# EasyEDA Pro project ProPrj_wildCat_2025-03-28.epro

# Schematic Schematic3_1
Board Name: 4ldouble; Create Date: 2025-03-23; Page Name: P1; Project Name: wildCat; Schematic Name: Schematic3_1; Update Date: 2025-03-23; Company: 嘉立创EDA; Page Size: A4; Version: V1.0
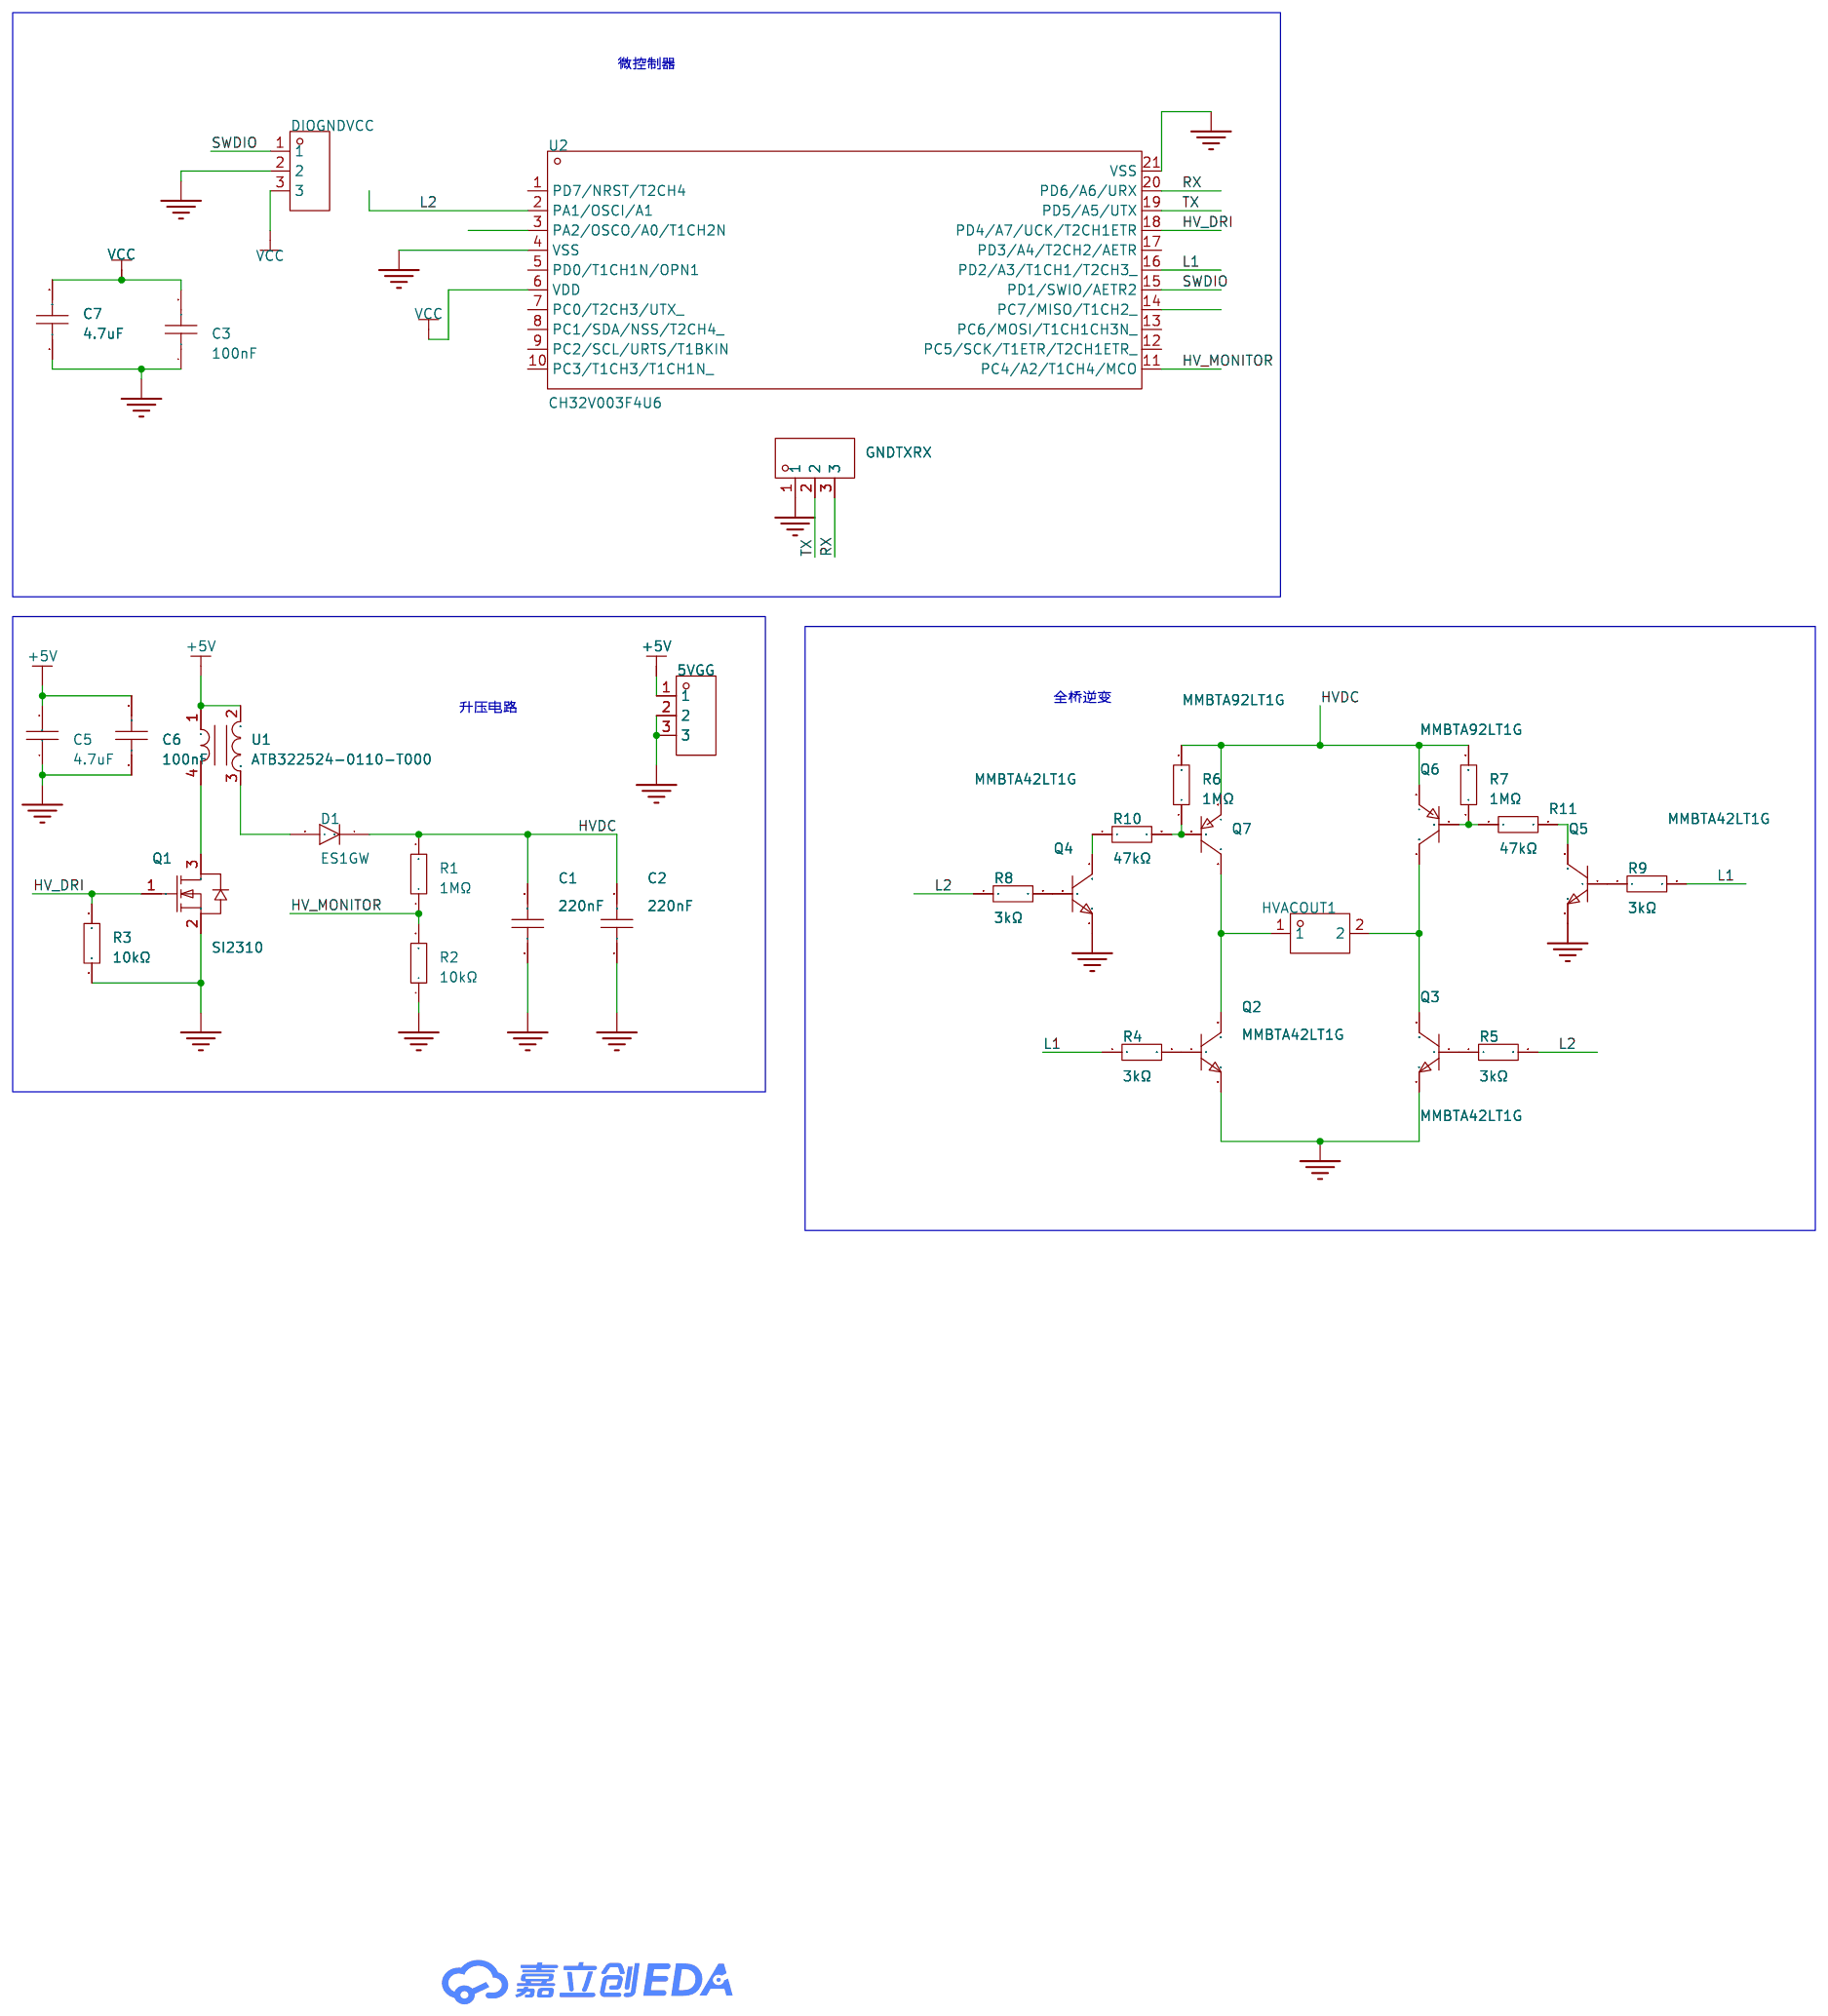
[diagram p0: schematic sheet]

## Parts
5VGG  -  [HDR-TH_3P-P2.54-V-F]
C1  220nF  [C1210]
C2  220nF  [C1210]
C3  100nF  [C0603]
C5  4.7uF  [C0805]
C6  100nF  [C0603]
C7  4.7uF  [C0603]
D1  ES1GW  [SOD-123FL_L2.7-W1.8-LS3.8-RD]
DIOGNDVCC  -  [HDR-TH_3P-P2.54-V-F]
GNDTXRX  -  [HDR-TH_3P-P2.54-V-F]
HVACOUT1  -  [HDR-TH_2P-P2.54-V-M-2]
Q1  SI2310  [SOT-23_L2.9-W1.3-P1.90-LS2.4-BR]
Q2  MMBTA42LT1G  [SOT-23-3_L2.9-W1.6-P1.90-LS2.8-BR]
Q3  MMBTA42LT1G  [SOT-23-3_L2.9-W1.6-P1.90-LS2.8-BR]
Q4  MMBTA42LT1G  [SOT-23-3_L2.9-W1.6-P1.90-LS2.8-BR]
Q5  MMBTA42LT1G  [SOT-23-3_L2.9-W1.6-P1.90-LS2.8-BR]
Q6  MMBTA92LT1G  [SOT-23-3_L2.9-W1.6-P1.90-LS2.8-BR]
Q7  MMBTA92LT1G  [SOT-23-3_L2.9-W1.6-P1.90-LS2.8-BR]
R1  1MΩ  [R1206]
R2  10kΩ  [R0402]
R3  10kΩ  [R0402]
R4  3kΩ  [R0402]
R5  3kΩ  [R0402]
R6  1MΩ  [R0402]
R7  1MΩ  [R0402]
R8  3kΩ  [R0402]
R9  3kΩ  [R0402]
R10  47kΩ  [R1206]
R11  47kΩ  [R1206]
U1  ATB322524-0110-T000  [XFMR-SMD_ATB322515-0110-T000]
U2  CH32V003F4U6  [QFN-20_L3.0-W3.0-P0.40-TL-EP1.7]

## Library data of the parts
5VGG DIOGNDVCC GNDTXRX = HDR-F_2.54_1x3P: Supplier Part: C541850; Supplier Footprint: 插件; Check: false
C1 C2 = CC1210KKX7RYBB224: 容值:220nF;精度:±10%;额定电压:250V;材质(温度系数):X7R;; LCSC Part Name: 220nF ±10% 250V; Supplier Part: C326671; Manufacturer: YAGEO(国巨); Supplier Footprint: 1210; JLCPCB Part Class: 扩展库; Datasheet: https://atta.szlcsc.com/upload/public/pdf/source/20181031/C326671_E05A76D6DA213ECA4F67921FD917BD9F.pdf; Supplier: LCSC; Tolerance: ±10%; Voltage Rated: 250V; Temperature Coefficient: X7R
C3 C6 = CGA0603X7R104K500JT: 容值:100nF;精度:±10%;额定电压:50V;温度系数:X7R;; LCSC Part Name: 100nF ±10% 50V; Supplier Part: C6119867; Manufacturer: HRE(芯声); Supplier Footprint: 0603; JLCPCB Part Class: 扩展库; Datasheet: https://atta.szlcsc.com/upload/public/pdf/source/20250103/C44077DA9E7B3EFAE02F22B6D3D1CBC9.pdf; Supplier: LCSC; Tolerance: ±10%; Voltage Rating: 50V; Temperature Coefficient: X7R
C5 = CL21A475KBQNNNE: 容值:4.7uF;精度:±10%;额定电压:50V;材质(温度系数):X5R;; LCSC Part Name: 4.7uF ±10% 50V; Supplier Part: C98192; Manufacturer: SAMSUNG(三星); Supplier Footprint: 0805; JLCPCB Part Class: 扩展库; Datasheet: https://atta.szlcsc.com/upload/public/pdf/source/20160218/1457707763339.pdf; Supplier: LCSC; Tolerance: ±10%; Voltage Rated: 50V; Temperature Coefficient: X5R
C7 = CL10A475KO8NNNC: 容值:4.7uF;精度:±10%;额定电压:16V;材质(温度系数):X5R;; LCSC Part Name: 4.7uF ±10% 16V; Supplier Part: C19666; Manufacturer: SAMSUNG(三星); Supplier Footprint: 0603; JLCPCB Part Class: Basic Part; Datasheet: https://atta.szlcsc.com/upload/public/pdf/source/20160218/1457707763339.pdf; Supplier: LCSC; Tolerance: ±10%; Voltage Rated: 16V; Temperature Coefficient: X5R
D1 = ES1GW_C128697: 二极管配置:独立式;正向压降(Vf):1.25V@1A;直流反向耐压(Vr):400V;整流电流:1A;反向恢复时间(trr):35ns;; Supplier Part: C128697; Manufacturer: 晶导微电子; Supplier Footprint: SOD-123F; JLCPCB Part Class: 扩展库; Datasheet: https://atta.szlcsc.com/upload/public/pdf/source/20170918/C128697_1505700123436974922.pdf; Supplier: LCSC; Diode Configuration: 独立式; Forward Voltage (Vf@If): 1.25V@1A; Reverse Voltage (Vr): 400V; Rectified Current: 1A; Reverse Leakage Current (Ir): 5uA@400V; Reverse Recovery Time (trr): 35ns; Operating Temperature: -55℃~+150℃@(Tj)
HVACOUT1 = HDR-M_2.54_2x1: Supplier Part: C2883961; Supplier Footprint: 插件,P=2.54mm; Check: false
Q1 = SI2310_C2938374: 类型:-;漏源电压(Vdss):60V;连续漏极电流(Id):3A;导通电阻(RDS(on)):125mΩ@4.5V,3A;耗散功率(Pd):1.5W;阈值电压(Vgs(th)):500mV;; LCSC Part Name: N沟道,电流:3A,耐压:60V; Supplier Part: C2938374; Manufacturer: GOODWORK(固得沃克); Supplier Footprint: SOT-23; JLCPCB Part Class: 扩展库; Datasheet: https://atta.szlcsc.com/upload/public/pdf/source/20240805/D069A40A104CC19EC37E6FD1F86C8B27.pdf; Supplier: LCSC; Drain to Source Voltage: 60V; Current - Continuous Drain(Id): 3A; RDS(on): 125mΩ@4.5V,3A; Pd - Power Dissipation: 1.5W; Gate Threshold Voltage (Vgs(th)@Id): 500mV; Gate Charge(Qg): 6nC@10V; Input Capacitance(Ciss@Vds): 247pF; Reverse Transfer Capacitance (Crss@Vds): 19.5pF; Operating Temperature: -55℃~+150℃
Q2-Q5 = MMBTA42LT1G: 晶体管类型:NPN;集电极电流(Ic):500mA;集射极击穿电压(Vceo):300V;功率(Pd):225mW;直流电流增益(hFE@Ic,Vce):25@10mA,10V;; LCSC Part Name: NPN 电流:500mA 耐压:300V; Supplier Part: C94389; Manufacturer: onsemi(安森美); Supplier Footprint: SOT-23; JLCPCB Part Class: Extended Part; Datasheet: https://atta.szlcsc.com/upload/public/pdf/source/20191223/C462960_9D0C1868A1806633932A5B836B4BA46D.pdf; Supplier: LCSC; Transistor Type: NPN; Collector Current (Ic): 500mA; Collector-Emitter Breakdown Voltage (Vceo): 300V; Power Dissipation (Pd): 225mW; DC Current Gain (hFE@Ic,Vce): 25@10mA,10V; Transition Frequency (fT): 50MHz; Collector Cut-Off Current (Icbo): 100nA; Collector-Emitter Saturation Voltage (VCE(sat)@Ic,Ib): 500mV@20mA,2.0mA; Operating Temperature: -55℃~+150℃
Q6 Q7 = MMBTA92LT1G: 晶体管类型:PNP;集电极电流(Ic):500mA;集射极击穿电压(Vceo):300V;功率(Pd):225mW;直流电流增益(hFE@Ic,Vce):25@1.0mA,10V;; LCSC Part Name: PNP 电流:500mA 耐压:300V; Supplier Part: C82049; Manufacturer: onsemi(安森美); Supplier Footprint: SOT-23; JLCPCB Part Class: Extended Part; Datasheet: https://atta.szlcsc.com/upload/public/pdf/source/20160910/1473490306913.PDF; Supplier: LCSC; Transistor Type: PNP; Collector Current (Ic): 500mA; Collector-Emitter Breakdown Voltage (Vceo): 300V; Power Dissipation (Pd): 225mW; DC Current Gain (hFE@Ic,Vce): 25@1.0mA,10V; Transition Frequency (fT): 50MHz; Collector Cut-Off Current (Icbo): 250nA; Collector-Emitter Saturation Voltage (VCE(sat)@Ic,Ib): 500mV@20mA,2.0mA; Operating Temperature: -55℃~+150℃
R1 R6 R7 = 0402WGF1004TCE: 电阻类型:厚膜电阻;阻值:1MΩ;精度:±1%;功率:62.5mW;最大工作电压:50V;温度系数:±100ppm/℃;; LCSC Part Name: 1MΩ ±1% 62.5mW 厚膜电阻; Supplier Part: C26083; Manufacturer: UNI-ROYAL(厚声); Supplier Footprint: 0402; JLCPCB Part Class: Basic Part; Datasheet: https://atta.szlcsc.com/upload/public/pdf/source/20200306/C422600_1E6D84923E4A46A82E41ADD87F860B5C.pdf; Supplier: LCSC; Type: 厚膜电阻; Tolerance: ±1%; Power(Watts): 62.5mW; Overload Voltage (Max): 50V; Temperature Coefficient: ±100ppm/℃; Operating Temperature Range: -55℃~+155℃
R2 R3 = 0402WGF1002TCE: 电阻类型:厚膜电阻;阻值:10kΩ;精度:±1%;功率:62.5mW;最大工作电压:50V;温度系数:±100ppm/℃;; LCSC Part Name: 10kΩ ±1% 62.5mW 厚膜电阻; Supplier Part: C25744; Manufacturer: UNI-ROYAL(厚声); Supplier Footprint: 0402; JLCPCB Part Class: Basic Part; Datasheet: https://atta.szlcsc.com/upload/public/pdf/source/20200306/C422600_1E6D84923E4A46A82E41ADD87F860B5C.pdf; Supplier: LCSC; Type: 厚膜电阻; Tolerance: ±1%; Power(Watts): 62.5mW; Overload Voltage (Max): 50V; Temperature Coefficient: ±100ppm/℃; Operating Temperature Range: -55℃~+155℃
R4 R5 R8 R9 = FRC0402F3001TS: 电阻类型:厚膜电阻;阻值:3kΩ;精度:±1%;功率:62.5mW;最大工作电压:50V;温度系数:±100ppm/℃;; LCSC Part Name: 3kΩ ±1% 62.5mW 厚膜电阻; Supplier Part: C2909355; Manufacturer: FOJAN(富捷); Supplier Footprint: 0402; JLCPCB Part Class: Extended Part; Datasheet: https://atta.szlcsc.com/upload/public/pdf/source/20211221/925EC7D7225764EE0046F22065062C87.pdf; Supplier: LCSC; Type: 厚膜电阻; Tolerance: ±1%; Power(Watts): 62.5mW; Overload Voltage (Max): 50V; Temperature Coefficient: ±100ppm/℃; Operating Temperature Range: -55℃~+155℃
R10 R11 = 0402WGF4702TCE: 电阻类型:厚膜电阻;阻值:47kΩ;精度:±1%;功率:62.5mW;最大工作电压:50V;温度系数:±100ppm/℃;; LCSC Part Name: 47kΩ ±1% 62.5mW 厚膜电阻; Supplier Part: C25792; Manufacturer: UNI-ROYAL(厚声); Supplier Footprint: 0402; JLCPCB Part Class: Basic Part; Datasheet: https://atta.szlcsc.com/upload/public/pdf/source/20200306/C422600_1E6D84923E4A46A82E41ADD87F860B5C.pdf; Supplier: LCSC; Type: 厚膜电阻; Tolerance: ±1%; Power(Watts): 62.5mW; Overload Voltage (Max): 50V; Temperature Coefficient: ±100ppm/℃; Operating Temperature Range: -55℃~+155℃
U1 = ATB322524-0110-T000: 初级电压:-;次级电压:-;输出电流:-;功率:-;; LCSC Part Name: 升压变压器; Supplier Part: C249001; Manufacturer: TDK; Supplier Footprint: SMD; JLCPCB Part Class: 扩展库; Datasheet: https://atta.szlcsc.com/upload/public/pdf/source/20180719/C249001_45035A300399F2A41F111958812A8988.pdf; Supplier: LCSC
U2 = CH32V003F4U6: CPU内核:RISC-V;程序存储容量:16KB;RAM总容量:2KB;GPIO端口数量:18;工作电压范围:-;CPU最大主频:48MHz;程序存储器类型:-;应用领域:-;; Supplier Part: C5299908; Manufacturer: WCH(南京沁恒); Supplier Footprint: QFN-20(3X3); JLCPCB Part Class: 扩展库; Datasheet: https://atta.szlcsc.com/upload/public/pdf/source/20240313/77CE2EF5E2A3AF5A92256F1D84EF4244.pdf; Supplier: LCSC; CPU Core: RISC-V; Program Storage Size: 16KB; RAM Size: 2KB; GPIO Ports Number: 18; CPU Maximum Speed: 48MHz; UART/USART: 1; I2C: 1; SPI: 1; Watchdog: 有; Real-Time Clock: 有

## Nets
+5V: 5VGG.1 C5.2 C6.2 U1.1 U1.2
GND: 5VGG.2 5VGG.3 C1.1 C2.1 C3.1 C5.1 C6.1 C7.1 DIOGNDVCC.2 GNDTXRX.1 Q1.2(S) Q2.2 Q3.2 Q4.2 Q5.2 R2.1 R3.1 U2.4(VSS) U2.21(VSS)
VCC: C3.2 C7.2 DIOGNDVCC.3 U2.6(VDD)
HV_DRI: Q1.1(G) R3.2 U2.18(PD4/A7/UCK/T2CH1ETR)
HV_MONITOR: R1.1 R2.2 U2.11(PC4/A2/T1CH4/MCO)
HVDC: C1.2 C2.2 D1.1(C) Q6.2(E) Q7.2(E) R1.2 R6.2 R7.2
L1: R4.1 R9.2 U2.16(PD2/A3/T1CH1/T2CH3_)
L2: R5.2 R8.1 U2.2(PA1/OSCI/A1)
RX: GNDTXRX.3 U2.20(PD6/A6/URX)
SWDIO: DIOGNDVCC.1 U2.15(PD1/SWIO/AETR2)
TX: GNDTXRX.2 U2.19(PD5/A5/UTX)
$1N1488: Q5.3 R11.2
$1N1491: Q5.1 R9.1
$1N1498: Q3.1 R5.1
$1N1505: Q6.1(B) R7.1 R11.1
$1N1517: HVACOUT1.2 Q3.3 Q6.3(C)
$1N1527: D1.2(A) U1.3
$1N1533: Q4.1 R8.2
$1N1535: Q4.3 R10.1
$1N1547: Q1.3(D) U1.4
$1N1565: HVACOUT1.1 Q2.3 Q7.3(C)
$1N1566: Q2.1 R4.2
$1N1568: Q7.1(B) R6.1 R10.2

Not connected (* = marked no-connect by the designer): U2 1(PD7/NRST/T2CH4) 3(PA2/OSCO/A0/T1CH2N) 5(PD0/T1CH1N/OPN1) 7(PC0/T2CH3/UTX_) 8(PC1/SDA/NSS/T2CH4_) 9(PC2/SCL/URTS/T1BKIN) 10(PC3/T1CH3/T1CH1N_) 12(PC5/SCK/T1ETR/T2CH1ETR_) 13(PC6/MOSI/T1CH1CH3N_) 14(PC7/MISO/T1CH2_) 17(PD3/A4/T2CH2/AETR)

## Notes on the sheet
- 微控制器
- 升压电路
- 全桥逆变

# Board PCB2_1
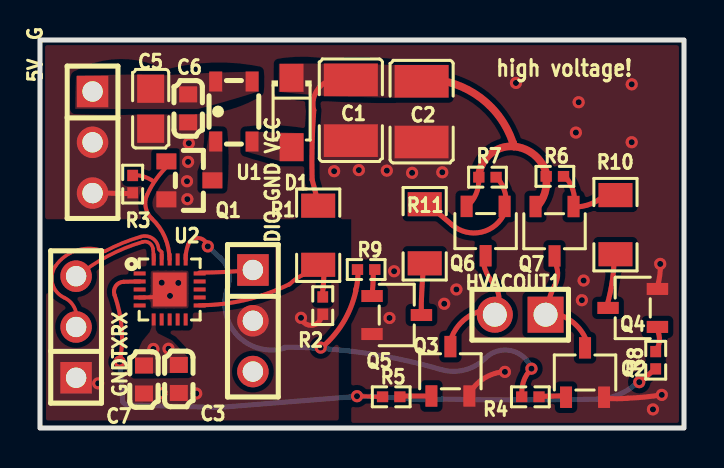
[diagram p1: board, top side]
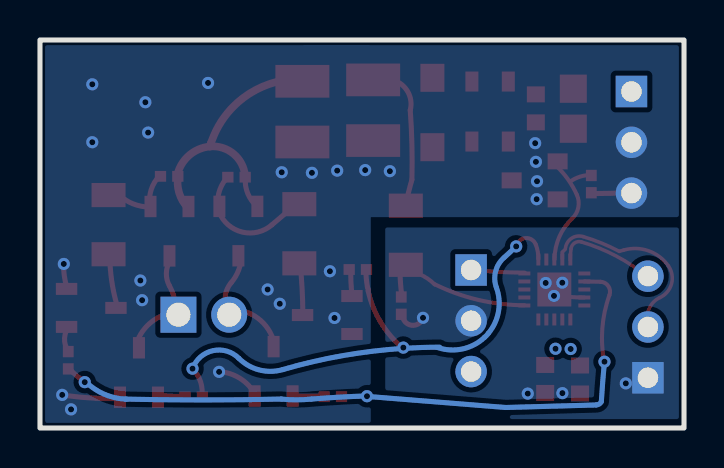
[diagram p2: board, bottom side, seen from below]

Outline 32.21 x 19.4 mm; copper layers: Top Layer, Inner1, Inner2, Bottom Layer. Coordinates in mm from the lower left corner of the outline.
Outline path: rectangle 0,19.4 32.21,0
Stack: Top Layer 0.035mm 外层铜厚1oz / Dielectric1 0.2104mm 7628 RC49% 8.6mil / Inner1 0.0152mm 内层铜厚 / Dielectric2 1.065mm 1.1mm H/HOZ Copper / Inner2 0.0152mm 内层铜厚 / Dielectric3 0.2104mm 7628 RC49% 8.6mil / Bottom Layer 0.035mm 外层铜厚1oz

## Design rules (mm)
net GND: LV
net +5V: LV
net HVDC: HV
net VCC: LV
net $1N1527: LV
net SWDIO: LV
net RX: LV
net TX: LV
net $1N1517: HV
net $1N1565: HV
net $1N1547: LV
net HV_DRI: LV
net $1N1566: LV
net $1N1498: LV
net $1N1533: LV
net $1N1535: HV
net $1N1491: LV
net $1N1488: HV
net $1N1505: HV
net $1N1568: HV
net HV_MONITOR: LV
net L1: LV
net L2: LV
template: 自定义配置
spacing copperThickness1oz (default): track to track 0.102, other pairs 0.152 to 0.3
spacing copperThickness2oz: track to track 0.203, other pairs 0.152 to 0.3
spacing HVClearance: track to track 0.254, other pairs 0.152 to 0.305
track width copperThickness1oz (default): min 0.127, default 0.254, max 2.54
track width copperThickness2oz: min 0.203, default 0.254, max 2.54
differential pair differentialPair (default): width min 0.127, default 0.254, max 2.54; gap min 0.152, default 0.152
via viaSize (default): diameter min 0.5, default 0.61, max 10; hole min 0.3, default 0.305, max 6.299
['net class', 'hv'] ['NET_CLASS', 'LV'] uses HVClearance

## Placement (name value [footprint] x y rotation side)
5V  G   G  -  [HDR-TH_3P-P2.54-V-F]  2.63 14.29 270 top
C1  220nF  [C1210]  15.55 15.89 90 top
C2  220nF  [C1210]  19.09 15.82 90 top
C3  100nF  [C0603]  6.94 2.45 90 top
C5  4.7uF  [C0805]  5.54 15.97 90 top
C6  100nF  [C0603]  7.41 15.98 90 top
C7  4.7uF  [C0603]  5.2 2.43 90 top
D1  ES1GW  [SOD-123FL_L2.7-W1.8-LS3.8-RD]  12.59 15.78 270 top
DIO GND VCC  -  [HDR-TH_3P-P2.54-V-F]  10.65 5.36 270 top
GNDTXRX  -  [HDR-TH_3P-P2.54-V-F]  1.81 5.05 90 top
HVACOUT1  -  [HDR-TH_2P-P2.54-V-M-2]  24.02 5.67 90 top
Q1  SI2310  [SOT-23_L2.9-W1.3-P1.90-LS2.4-BR]  7.47 12.38 180 top
Q2  MMBTA42LT1G  [SOT-23-3_L2.9-W1.6-P1.90-LS2.8-BR]  27.26 2.77 270 top
Q3  MMBTA42LT1G  [SOT-23-3_L2.9-W1.6-P1.90-LS2.8-BR]  20.53 2.84 270 top
Q4  MMBTA42LT1G  [SOT-23-3_L2.9-W1.6-P1.90-LS2.8-BR]  29.65 6.01 0 top
Q5  MMBTA42LT1G  [SOT-23-3_L2.9-W1.6-P1.90-LS2.8-BR]  17.84 5.65 180 top
Q6  MMBTA92LT1G  [SOT-23-3_L2.9-W1.6-P1.90-LS2.8-BR]  22.29 9.85 90 top
Q7  MMBTA92LT1G  [SOT-23-3_L2.9-W1.6-P1.90-LS2.8-BR]  25.74 9.84 90 top
R1  1MΩ  [R1206]  13.92 9.64 90 top
R2  10kΩ  [R0402]  14.14 6.12 90 top
R3  10kΩ  [R0402]  4.64 12.2 90 top
R4  3kΩ  [R0402]  24.53 1.56 0 top
R5  3kΩ  [R0402]  17.57 1.56 180 top
R6  1MΩ  [R0402]  25.75 12.58 180 top
R7  1MΩ  [R0402]  22.38 12.54 180 top
R8  3kΩ  [R0402]  30.8 3.39 90 top
R9  3kΩ  [R0402]  16.31 7.92 180 top
R10  47kΩ  [R1206]  28.78 10.17 90 top
R11  47kΩ  [R1206]  19.24 9.71 270 top
U1  ATB322524-0110-T000  [XFMR-SMD_ATB322515-0110-T000]  9.7 15.83 270 top
U2  CH32V003F4U6  [QFN-20_L3.0-W3.0-P0.40-TL-EP1.7]  6.49 6.93 0 top

## Footprints (pads in the part's own frame, mm; a bottom-side part is the same pattern mirrored in y, then rotated)
C0603
  rect 0.8x0.9 smd: 1(-0.7,0) 2(0.7,0)
C0805
  rect 1.41x1.35 smd: 1(-1,0) 2(1,0)
C1210
  rect 1.635x2.7 smd: 1(-1.518,0) 2(1.518,0)
HDR-TH_2P-P2.54-V-M-2
  rect 1.8x1.8 hole 1.2: 1(0,-1.27)
  round 1.8 hole 1.2: 2(0,1.27)
HDR-TH_3P-P2.54-V-F
  rect 1.575x1.575 hole 1.02: 1(-2.54,0)
  round 1.575 hole 1.02: 2(0,0) 3(2.54,0)
QFN-20_L3.0-W3.0-P0.40-TL-EP1.7
  rect 0.6x0.2 smd: 1(-1.5,0.8) 2(-1.5,0.401) 3(-1.5,0) 4(-1.5,-0.4) 5(-1.5,-0.8) 11(1.5,-0.8) 12(1.5,-0.4) 13(1.5,0) 14(1.5,0.401) 15(1.5,0.8)
  rect 0.2x0.6 smd: 6(-0.8,-1.5) 7(-0.4,-1.5) 8(0,-1.5) 9(0.4,-1.5) 10(0.799,-1.5) 16(0.8,1.5) 17(0.4,1.5) 18(0,1.5) 19(-0.4,1.5) 20(-0.8,1.5)
  rect 1.7x1.7 smd: 21(0,0)
R0402
  rect 0.566x0.54 smd: 1(-0.433,0) 2(0.433,0)
R1206
  rect 1.208x1.701 smd: 1(-1.479,0) 2(1.479,0)
SOD-123FL_L2.7-W1.8-LS3.8-RD
  rect 1.4x1.2 smd: 1(-1.735,0) 2(1.735,0)
SOT-23-3_L2.9-W1.6-P1.90-LS2.8-BR
  rect 1.07x0.6 smd: 1(1.235,-0.95) 2(1.235,0.95) 3(-1.235,0)
SOT-23_L2.9-W1.3-P1.90-LS2.4-BR
  rect 1x0.8 smd: 1(1.15,-0.95) 2(1.15,0.95) 3(-1.15,0)
XFMR-SMD_ATB322515-0110-T000
  rect 1x0.65 smd: 1(-1.5,-0.91) 2(-1.5,0.91) 3(1.5,0.91) 4(1.5,-0.91)

## Nets
As in the schematic, except:
+5V: 5V  G   G.1 C5.2 C6.2 U1.1 U1.2
GND: 5V  G   G.2 5V  G   G.3 C1.1 C2.1 C3.1 C5.1 C6.1 C7.1 DIO GND VCC.2 GNDTXRX.1 Q1.2 Q2.2 Q3.2 Q4.2 Q5.2 R2.1 R3.1 U2.4 U2.21
VCC: C3.2 C7.2 DIO GND VCC.3 U2.6
SWDIO: DIO GND VCC.1 U2.15

Pads without a net: U2 1 5 7 8 9 10 12 13 17

## Via types
v1: diameter 0.61, hole 0.305, Top Layer to Bottom Layer, 39 vias

## Routing (per net, layer and track width the routed paths; a pad name or vN(x,y) marks a point on that pad's centre or on a via; arc(x,y) is an arc through that point)
GND: length 18.1
  Top Layer w0.203: 4.98,6.53 arc(5.39,6.53) 5.8,6.56
  Top Layer w0.254: 23.39,2.82 arc(22.32,2.54) 21.51,1.78 ; v1(31.1,1.66) arc(30.25,1.55) 29.4,1.49 ; 31.04,8.24 arc(31,7.66) 30.89,7.09 ; 14.08,5.66 arc(13.63,5.14) v1(13.06,5.51) ; 29.4,1.49 arc(28.84,1.46) 28.28,1.49 ; 4.62,11.72 arc(3.69,11.73) 2.77,11.77
  Inner1 w0.254: 14.56,9.72 arc(13.77,11.71) 13.9,13.84 ; 14.26,2.87 arc(15.18,2.91) 16.1,3.03 ; 5.33,10.92 arc(5.44,10.57) 5.73,10.35 arc(6.01,10.11) 6.08,9.75
  vias: v1(2.91,2.23) v1(6.09,7.27) v1(6.08,1.74) v1(6.5,6.61) v1(6.92,7.25) v1(7.41,13.31) v1(7.35,12.34) v1(7.37,11.44) v1(7.45,14.24) v1(7.82,1.72) v1(14.71,12.84) v1(15.95,12.9) v1(17.35,12.87) v1(17.48,5.5) v1(17.71,7.84) v1(18.61,12.76) v1(20.12,12.79) v1(20.22,6.21) v1(20.83,6.93) v1(23.25,2.81) v1(23.81,17.26) v1(26.81,14.77) v1(26.94,16.29) v1(27.11,6.39) v1(27.19,7.38) v1(29.6,17.19) v1(29.6,14.29) v1(30.66,0.93) v1(31.02,8.2)
VCC:
  vias: v1(5.67,3.95) v1(6.43,3.96)
HV_DRI: length 6.4
  Top Layer w0.203: 4.68,12.65 arc(5.2,12.57) 5.68,12.33 ; 6.4,13.12 arc(5.81,12.44) 5.36,11.67 arc(5.29,11.03) 5.6,10.47 arc(6.25,9.54) 6.48,8.43
HV_MONITOR: length 7.7
  Top Layer w0.203: 7.97,6.14 arc(10.29,6.41) 12.48,7.19 ; 12.47,7.17 arc(13.23,7.7) 14.14,7.9
  Top Layer w0.254: 14.2,7.87 arc(14.18,7.26) 14.12,6.65
HVDC: length 21.2
  Top Layer w0.254: 13.92,11.12 arc(13.78,11.77) 13.61,12.41 ; 13.61,12.43 arc(13.61,14.16) 13.69,15.89 arc(13.81,16.81) 14.54,17.39 ; 21.31,11.04 arc(21.81,11.71) 21.94,12.53 arc(21.94,12.49) 21.94,12.46
  Top Layer w0.381: 23.71,14.08 arc(22.53,13.7) 21.96,12.6 ; 23.71,14.08 arc(22.04,16.51) 19.25,17.45 ; 23.71,14.08 arc(24.75,13.64) 25.34,12.69 ; 23.66,14.27 arc(23.68,14.2) 23.7,14.13 ; 25.3,12.64 arc(25.25,11.76) 24.81,11
L1: length 29.1
  Top Layer w0.203: 7.28,8.45 arc(7.31,8.82) 7.41,9.17 arc(7.94,9.5) v1(8.39,9.08)
  Top Layer w0.254: 13.97,3.92 arc(15.13,5.22) 15.79,6.84 15.79,6.9 arc(15.8,6.97) 15.83,7.04 arc(15.89,7.49) 15.91,7.95 ; v1(24.58,2.97) arc(24.18,2.3) 24.12,1.53
  Bottom Layer w0.254: 8.4,9.09 arc(8.7,8.8) 9.01,8.51 arc(9.43,7.83) 9.39,7.03 arc(9.28,5.83) 9.79,4.74 arc(9.87,4.63) 9.97,4.54 arc(11.07,3.95) 12.31,4.02 ; 12.22,4.04 arc(13.13,4.03) 14.04,3.98 arc(17.08,3.62) 20.07,2.92 arc(21.25,2.9) 22.27,3.49 arc(23.57,3.87) v1(24.58,2.97)
  vias: v1(14.04,4.02)
L2: length 35.7
  Top Layer w0.203: v1(15.86,1.59) arc(16.52,1.58) 17.18,1.54 ; U2.2 arc(4.58,7.32) 4.18,7.31 arc(3.79,7.09) 3.73,6.65 arc(4.09,4.96) 3.97,3.24
  Top Layer w0.254: 30.67,2.88 arc(30.35,2.59) 30,2.32
  Bottom Layer w0.254: 4.39,1.15 8.91,1.03 16,1.59 ; 27.93,1.44 arc(24.04,1.4) 20.14,1.45 arc(19.39,1.41) 18.64,1.45 arc(17.23,1.54) 15.82,1.61 ; 27.93,1.44 arc(27.9,1.44) 27.86,1.44 ; 27.93,1.44 arc(29.02,1.7) 29.94,2.32 ; 4.39,1.15 arc(4.24,1.2) 4.14,1.32 arc(4.07,2.3) 3.98,3.27
  vias: v1(3.98,3.32) v1(29.98,2.29)
RX: length 5.1
  Top Layer w0.178: 5.69,8.4 arc(5.68,8.69) 5.65,8.97 arc(5.47,9.26) 5.13,9.3 arc(3.38,8.59) 1.81,7.55
SWDIO: length 2.7
  Top Layer w0.203: 7.97,7.77 arc(9.3,7.8) 10.63,7.91
TX: length 9.8
  Top Layer w0.178: 5.94,8.94 6.09,8.79 6.09,8.47 ; 1.8,5.28 arc(1.73,6.01) 1.21,6.52 arc(0.63,7.21) 0.78,8.1 arc(1.77,8.86) 3.02,8.9 arc(3.13,8.86) 3.24,8.83 arc(4.13,9.25) 5.05,9.57 arc(5.62,9.49) 5.93,9.01
$1N1488: length 2.6
  Top Layer w0.254: 19.07,5.68 arc(19.11,7) 19.22,8.32
$1N1491: length 1.2
  Top Layer w0.254: 16.67,7.91 arc(16.66,7.3) 16.62,6.7
$1N1498: length 1.6
  Top Layer w0.254: 18.01,1.6 19.59,1.6
$1N1505: length 6.4
  Top Layer w0.254: 19.35,11.21 arc(19.99,10.69) 20.61,10.16 arc(22.09,9.8) 23.25,10.78 ; 22.78,12.6 arc(23.21,11.93) 23.32,11.13
$1N1517: length 6.4
  Top Layer w0.254: 22.71,5.66 arc(22.96,6.47) 22.65,7.27 arc(22.27,7.92) 22.14,8.66 ; 22.63,5.93 arc(21.17,5.37) 20.45,3.99
$1N1533: length 1.4
  Top Layer w0.254: 30.69,3.72 arc(30.98,4.33) 30.82,5
$1N1535: length 2.5
  Top Layer w0.254: 28.72,8.67 arc(28.63,7.4) 28.37,6.16
$1N1565: length 5.6
  Top Layer w0.254: 25.71,8.37 arc(25.89,7.75) 25.75,7.12 arc(25.48,6.47) 25.37,5.78 ; 25.37,5.78 arc(26.6,5.33) 27.37,4.26 ; 25.37,5.78 arc(25.36,5.69) 25.36,5.6
$1N1566: length 1.4
  Top Layer w0.254: 24.88,1.58 arc(25.59,1.59) 26.31,1.62
$1N1568: length 4.4
  Top Layer w0.254: 26.73,11.05 arc(27.58,11.22) 28.3,11.69 ; 26.23,12.61 arc(26.65,11.91) 26.71,11.1 ; 28.16,11.86 arc(28.39,11.49) 27.97,11.41

## Copper pours and planes (outline as drawn; the poured copper is in the pictures)
+5V on Top Layer: 1.76,17.82 10.94,17.82 10.94,15.95 1.76,15.95
GND on Top Layer: 1.7,15.68 5.1,15.68 5.1,11.65 1.7,11.65
GND on Top Layer: 4.84,15.69 7.86,15.69 7.86,10.88 4.84,10.88
GND on Top Layer: 0.98,3.3 7.39,3.3 7.39,1.32 0.98,1.32
GND on Top Layer: 15.56,10.85 32.21,10.85 32.21,0 15.56,0
GND on Top Layer: 14.18,15.2 20.55,15.2 20.55,12.43 14.18,12.43
GND on Top Layer: 0.3,9.99 14.94,9.99 14.94,0.38 0.3,0.38
GND on Top Layer: -0.01,19.47 32.21,19.47 32.21,10.44 -0.01,10.44
GND on Bottom Layer: 15.67,19.4 32.14,19.4 32.14,0.03 15.67,0.03
GND on Bottom Layer: 0.02,19.47 19.08,19.47 19.08,10.54 0.02,10.54
GND on Bottom Layer: 0.23,10.03 14.94,10.03 14.94,0.45 0.23,0.45
GND on Inner1: 15.42,11.58 31.76,11.58 31.76,0.41 15.42,0.41
GND on Inner1: 21.55,18.89 31.79,18.89 31.79,11.2 21.55,11.2
GND on Inner1: 0.24,10.05 14.87,10.05 14.87,0.41 0.24,0.41
GND on Inner1: 14.88,19.08 31.73,19.08 31.73,11.19 14.88,11.19
GND on Inner1: 0.18,19.25 21,19.25 21,12.87 0.18,12.87
GND on Inner1: 0.21,13.29 13.31,13.29 13.31,10.54 0.21,10.54
GND on Inner2: -0.04,19.42 32.22,19.42 32.22,10.73 -0.04,10.73
GND on Inner2: 15.51,11.17 32.15,11.17 32.15,0 15.51,0
VCC on Top Layer: 4.75,5.17 7.39,5.17 7.39,2.73 4.75,2.73
VCC on Inner2: 0.32,9.95 14.77,9.95 14.77,0.44 0.32,0.44
HVDC on Top Layer: 11.94,18.22 18.09,18.22 18.09,16.51 11.94,16.51
$1N1527 on Top Layer: 10.28,14.82 13.18,14.82 13.18,13.35 10.28,13.35
$1N1547 on Top Layer: 8.12,14.82 9.12,14.82 9.12,11.98 8.12,11.98

Small or netless copper shapes (teardrops, artwork), in the pictures only: 1 on Top Layer

## Text on the board
Top Silkscreen Layer: high voltage!
